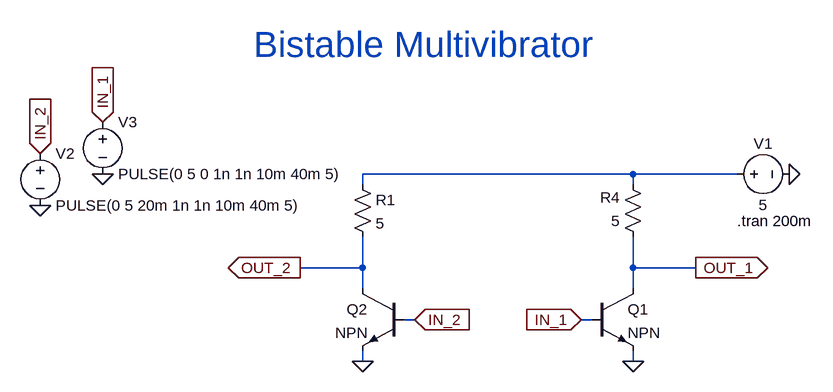
[diagram p0: schematic Bistable Multivibrator.asc]
Bistable Multivibrator.asc, the LTspice schematic file:
Version 4
SHEET 1 880 680
WIRE 400 -48 -16 -48
WIRE 560 -48 400 -48
WIRE -16 -32 -16 -48
WIRE 400 -32 400 -48
WIRE -16 96 -16 48
WIRE -16 96 -112 96
WIRE 400 96 400 48
WIRE 496 96 400 96
WIRE -16 128 -16 96
WIRE 400 128 400 96
WIRE 64 176 48 176
WIRE 336 176 320 176
WIRE -16 240 -16 224
WIRE 400 240 400 224
FLAG 496 96 OUT_1
IOPIN 496 96 Out
FLAG -112 96 OUT_2
IOPIN -112 96 Out
FLAG 640 -48 0
FLAG -16 240 0
FLAG 400 240 0
FLAG -512 0 0
FLAG -416 -48 0
FLAG 320 176 IN_1
IOPIN 320 176 In
FLAG -416 -128 IN_1
IOPIN -416 -128 In
FLAG -512 -80 IN_2
IOPIN -512 -80 In
FLAG 64 176 IN_2
IOPIN 64 176 In
SYMBOL npn 336 128 R0
SYMATTR InstName Q1
SYMBOL npn 48 128 M0
SYMATTR InstName Q2
SYMBOL voltage 544 -48 R270
WINDOW 0 32 56 VTop 2
WINDOW 3 -32 56 VBottom 2
WINDOW 123 0 0 Left 0
WINDOW 39 0 0 Left 0
SYMATTR InstName V1
SYMATTR Value 5
SYMBOL res -32 -48 R0
SYMATTR InstName R1
SYMATTR Value 5
SYMBOL res 416 64 R180
WINDOW 0 36 76 Left 2
WINDOW 3 36 40 Left 2
SYMATTR InstName R4
SYMATTR Value 5
SYMBOL voltage -512 -96 R0
WINDOW 123 0 0 Left 0
WINDOW 39 0 0 Left 0
SYMATTR InstName V2
SYMATTR Value PULSE(0 5 20m 1n 1n 10m 40m 5)
SYMBOL voltage -416 -144 R0
WINDOW 123 0 0 Left 0
WINDOW 39 0 0 Left 0
SYMATTR InstName V3
SYMATTR Value PULSE(0 5 0 1n 1n 10m 40m 5)
TEXT 560 24 Left 2 !.tran 200m
TEXT -184 -248 Left 5 ;Bistable Multivibrator

The netlist it stands for:
* Bistable Multivibrator.asc
Q1 OUT_1 IN_1 0 0 NPN
Q2 OUT_2 IN_2 0 0 NPN
V1 N001 0 5
R1 N001 OUT_2 5
R4 OUT_1 N001 5
V2 IN_2 0 PULSE(0 5 20m 1n 1n 10m 40m 5)
V3 IN_1 0 PULSE(0 5 0 1n 1n 10m 40m 5)
.model NPN NPN
.model PNP PNP
.lib standard.bjt
.tran 200m
* Bistable Multivibrator
.backanno
.end